# EAGLE schematic lab2Schematic (EAGLE 9.4.2)
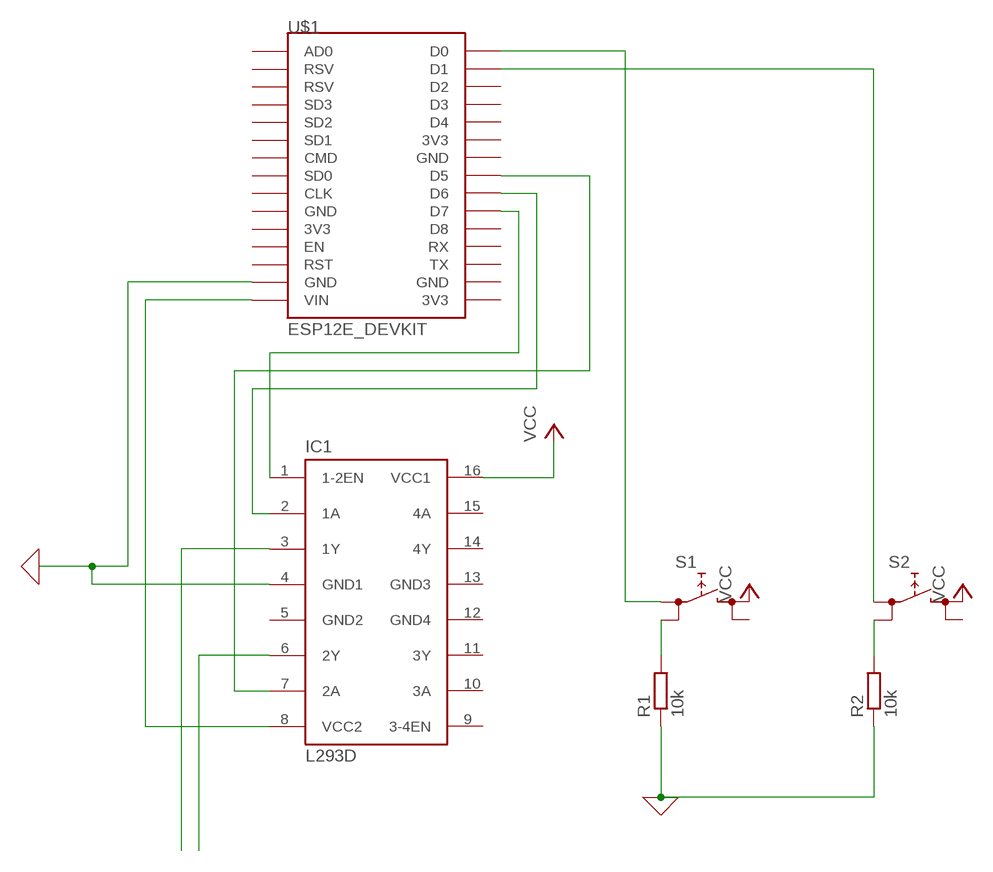
[diagram p0: schematic, sheet 1]

## Parts
IC1  L293D  [DIL16]
R1  10k  R-EU_0207/10  [0207/10]
R2  10k  R-EU_0207/10  [0207/10]
S1  REKN  [REKN]
S2  REKN  [REKN]
U$1  ESP12E_DEVKIT  [ESP12E_DEVKIT]

## Nets
0: IC1.4(GND1) R1.1 R2.1 U$1.GND@1(GND) ; supply symbol labelled GND
N$1: R1.2 S1.0B
N$2: IC1.8(VCC2) U$1.VIN
N$3: R2.2 S2.0B
N$4: S1.0A U$1.D0
N$5: S2.0A U$1.D1
N$6: IC1.2(1A) U$1.D6
N$7: IC1.7(2A) U$1.D5
N$8: IC1.1(1-2EN) U$1.D7
N$9: IC1.3(1Y)
N$10: IC1.6(2Y)
VCC: IC1.16(VCC1) S1.1A S2.1A
Unconnected: IC1.9(3-4EN) IC1.10(3A) IC1.11(3Y) IC1.14(4Y) IC1.15(4A) S1.1B S2.1B U$1.3V3@0(3V3) U$1.3V3@1(3V3) U$1.3V3@2(3V3) U$1.AD0 U$1.CLK U$1.CMD U$1.D2 U$1.D3 U$1.D4 U$1.D8 U$1.EN U$1.GND@0(GND) U$1.GND@2(GND) U$1.GND@3(GND) U$1.RST U$1.RSV@0(RSV) U$1.RSV@1(RSV) U$1.RX U$1.SD0 U$1.SD1 U$1.SD2 U$1.SD3 U$1.TX

## Power pins joined to a net without a drawn wire
GND2: IC1.5(GND2)
GND3: IC1.13(GND3)
GND4: IC1.12(GND4)

## Library data of the parts
IC1 = st-microelectronics:L293D: PUSH-PULL 4 CHANNEL DRIVER; MPN: L293D; OC_FARNELL: 9589619; OC_NEWARK: 56P8249
R1 R2 = rcl:R-EU_: RESISTOR, European symbol; SPICEPREFIX: R
S1 S2 = switch:REKN: PUSH SWITCH ITT-Cannon-Cannon
U$1 = ESP12E_DEVKIT:ESP12E_DEVKIT: ESP12E DEVKIT BOARD